# Altium schematic sheet P1_TOP_LEVEL.SchDoc
size B; Organization: Misfit Wearables; Address1: 374 Woodrow St; Address2: Daly City; Address3: CA; Address4: USA
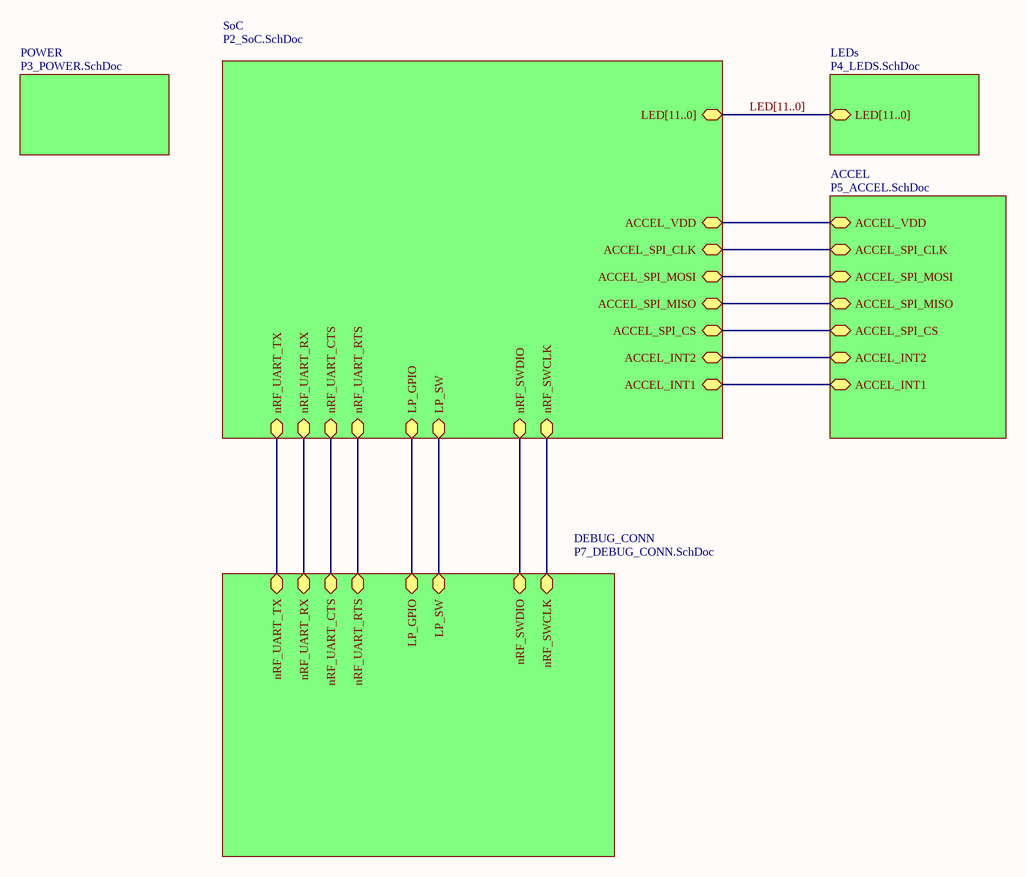
[diagram p0: P1_TOP_LEVEL.SchDoc]

## Sub-sheets
ACCEL = P5_ACCEL.SchDoc: ACCEL_SPI_CLK, ACCEL_SPI_MOSI, ACCEL_SPI_MISO, ACCEL_SPI_CS, ACCEL_INT2, ACCEL_INT1, ACCEL_VDD
DEBUG_CONN = P7_DEBUG_CONN.SchDoc: nRF_SWDIO, nRF_SWCLK, nRF_UART_TX, nRF_UART_RX, nRF_UART_CTS, nRF_UART_RTS, LP_GPIO, LP_SW
LEDs = P4_LEDS.SchDoc: LED[11..0]
POWER = P3_POWER.SchDoc: no entries
SoC = P2_SoC.SchDoc: nRF_SWCLK, ACCEL_SPI_MOSI, ACCEL_INT1, ACCEL_INT2, nRF_SWDIO, ACCEL_SPI_MISO, ACCEL_SPI_CS, ACCEL_VDD, ACCEL_SPI_CLK, LED[11..0], nRF_UART_TX, nRF_UART_RX, nRF_UART_CTS, nRF_UART_RTS, LP_GPIO, LP_SW

## Nets
(unnamed): sheet SoC/nRF_SWCLK, sheet DEBUG_CONN/nRF_SWCLK
(unnamed): sheet SoC/ACCEL_SPI_MOSI, sheet ACCEL/ACCEL_SPI_MOSI
(unnamed): sheet SoC/ACCEL_INT1, sheet ACCEL/ACCEL_INT1
(unnamed): sheet SoC/ACCEL_INT2, sheet ACCEL/ACCEL_INT2
(unnamed): sheet SoC/nRF_SWDIO, sheet DEBUG_CONN/nRF_SWDIO
(unnamed): sheet SoC/ACCEL_SPI_MISO, sheet ACCEL/ACCEL_SPI_MISO
(unnamed): sheet SoC/ACCEL_SPI_CS, sheet ACCEL/ACCEL_SPI_CS
(unnamed): sheet SoC/ACCEL_VDD, sheet ACCEL/ACCEL_VDD
(unnamed): sheet SoC/ACCEL_SPI_CLK, sheet ACCEL/ACCEL_SPI_CLK
(unnamed): sheet SoC/nRF_UART_TX, sheet DEBUG_CONN/nRF_UART_TX
(unnamed): sheet SoC/nRF_UART_RX, sheet DEBUG_CONN/nRF_UART_RX
(unnamed): sheet SoC/nRF_UART_CTS, sheet DEBUG_CONN/nRF_UART_CTS
(unnamed): sheet SoC/nRF_UART_RTS, sheet DEBUG_CONN/nRF_UART_RTS
(unnamed): sheet SoC/LP_GPIO, sheet DEBUG_CONN/LP_GPIO
(unnamed): sheet SoC/LP_SW, sheet DEBUG_CONN/LP_SW

## Buses and harness runs
bus LED[11..0] = sheet LEDs/LED[11..0] = sheet SoC/LED[11..0]

## Notes on the sheet
- Title
- Size:
- Date:
- B
- Number:
- Time:
- Revision:
- Sheet
- of
- File: